# EAGLE design pb-switch-pcb (EAGLE 9.6.2)
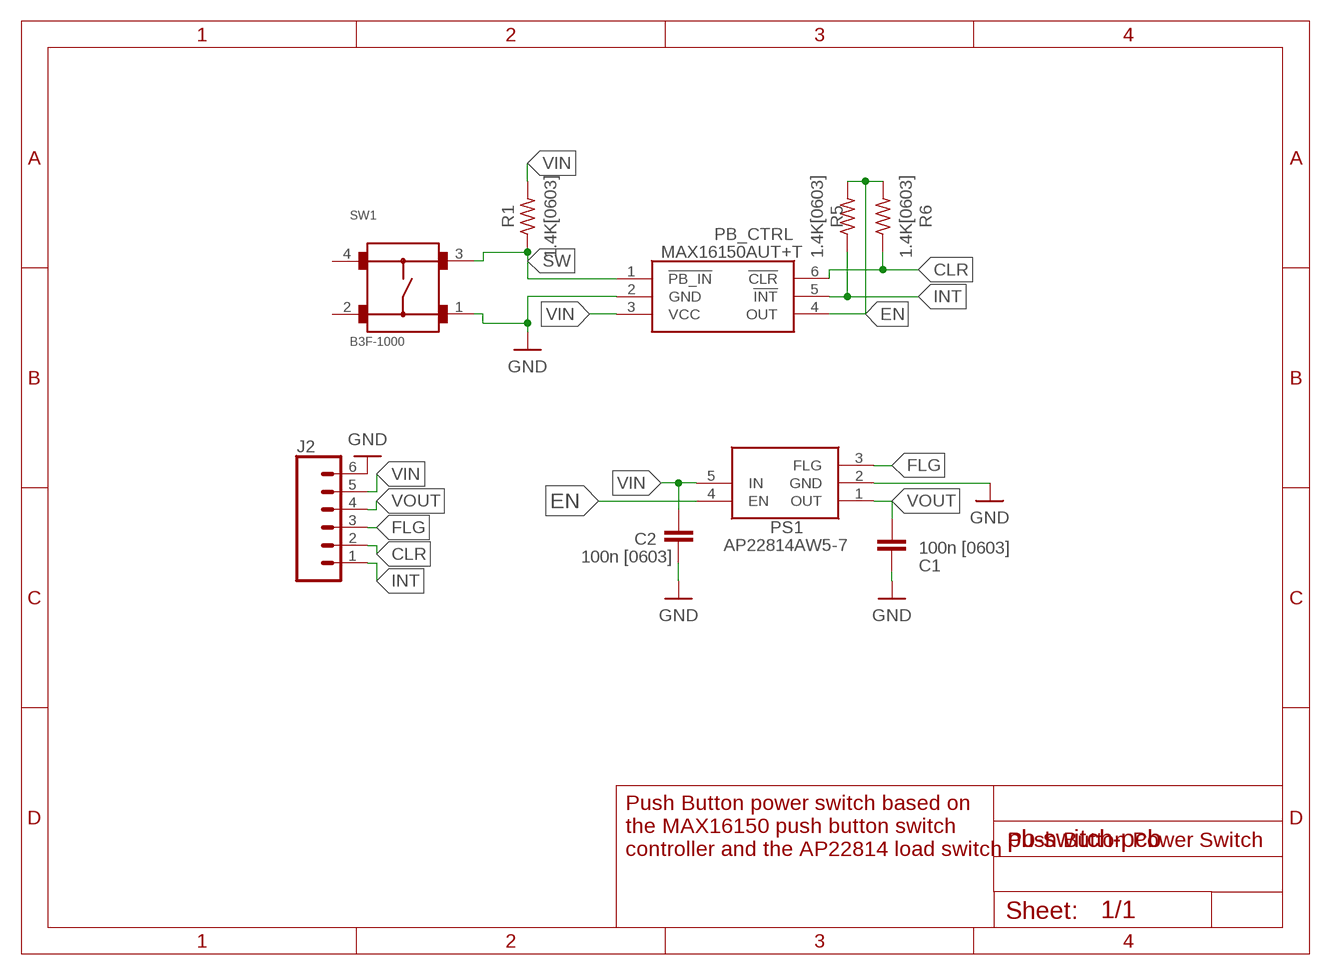
[diagram p0: schematic, sheet 1]

## Parts
C1  100n [0603]  C_CHIP-0603(1608-METRIC)  [CAPC1608X85]
C2  100n [0603]  C_CHIP-0603(1608-METRIC)  [CAPC1608X85]
J2  CONN_06SILK_FEMALE_PTH  [1X06]
PB_CTRL  MAX16150AUT+T  [SOT95P280X145-6N]
PS1  AP22814AW5-7  [SOT95P285X130-5N]
R1  1.4K[0603]  R-US_CHIP-0603(1608-METRIC)  [RESC1608X60]
R5  1.4K[0603]  R-US_CHIP-0603(1608-METRIC)  [RESC1608X60]
R6  1.4K[0603]  R-US_CHIP-0603(1608-METRIC)  [RESC1608X60]
SW1  B3F-1000  [B3F-1000]

## Nets
CLR: J2.2 PB_CTRL.6(!CLR) R6.1
EN: PB_CTRL.4(OUT) PS1.4(EN) R5.2 R6.2
FLG: J2.3 PS1.3(FLG)
GND: C1.2 C2.2 J2.6 PB_CTRL.2(GND) PS1.2(GND) SW1.1
INT: J2.1 PB_CTRL.5(!INT) R5.1
SW: PB_CTRL.1(!PB_IN) R1.1 SW1.3
VIN: C2.1 J2.5 PB_CTRL.3(VCC) PS1.5(IN) R1.2
VOUT: C1.1 J2.4 PS1.1(OUT)
Unconnected: SW1.2 SW1.4

## Notes on the sheet
- Push Button Power Switch
- Push Button power switch based on 
  the MAX16150 push button switch 
  controller and the AP22814 load switch

## Library data of the parts
C1 C2 = Capacitor:C: Capacitor - Generic; CATEGORY: Capacitor
J2 = SparkFun-Connectors:CONN_06: Multi connection point. Often used as Generic Header-pin footprint for 0.1 inch spaced/style header connections On any of the 0.1 inch spaced packages, you can populate with these: Break Away Headers - Straight <https://www.sparkfun.com/products/116> (PRT-00116) Break Away Male Headers - Right Angle <https://www.sparkfun.com/products/553> (PRT-00553) Female Headers <https://www.sparkfun.com/products/115> (PRT-00115) Break Away Headers - Machine Pin <https://www.sparkfun.com/products/117> (PRT-00117) Break Away Female Headers - Swiss Machine Pin <https://www.sparkfun.com/products/743> (PRT-00743) Arduino Stackable Header - 6 Pin <https://www.sparkfun.com/products/9280> (PRT-09280) For SCREWTERMINALS and SPRING TERMINALS visit here: Screw Terimnals on SparkFun.com <https://www.sparkfun.com/search/results?term=Screw+Terminals> (5mm/3.5mm/2.54mm spacing) This device is also useful as a general connection point to wire up your design to another part of your project. Our various solder wires solder well into these plated through hole pads. Hook-Up Wire - Assortment (Stranded, 22 AWG) <https://www.sparkfun.com/products/11375> (PRT-11375) Hook-Up Wire - Assortment (Solid Core, 22 AWG) <https://www.sparkfun.com/products/11367> (PRT-11367) View the entire wire category on our website here <https://www.sparkfun.com/categories/141>; PROD_ID: CONN-08437
PB_CTRL = MAX16150AUT+T:MAX16150AUT+T: Supervisory Circuits Nano-Power Pushbutton ON/OFF Controller with 15kV ESD Protection and Programmable Timer Source: Datasheet; DESCRIPTION: Supervisory Circuits Nano-Power Pushbutton ON/OFF Controller with 15kV ESD Protection and Programmable Timer; HEIGHT: 1.45mm; MANUFACTURER_NAME: Maxim Integrated; MANUFACTURER_PART_NUMBER: MAX16150AUT+T; MOUSER_PART_NUMBER: 700-MAX16150AUT+T; MOUSER_PRICE-STOCK: https://www.mouser.co.uk/ProductDetail/Maxim-Integrated/MAX16150AUT%2bT?qs=wnTfsH77Xs5xR8unQygqcw%3D%3D
PS1 = AP22814AW5-7:AP22814AW5-7: DiodesZetex AP22814AW5-7, USB Power Switch, High Side, 65m, 1.6 V min. 5-Pin, SOT25 Source: Datasheet <https://componentsearchengine.com/Datasheets/2/AP22814AW5-7.pdf>; DESCRIPTION: DiodesZetex AP22814AW5-7, USB Power Switch, High Side, 65m, 1.6 V min. 5-Pin, SOT25; HEIGHT: 1.3mm; MANUFACTURER_NAME: Diodes Inc.; MANUFACTURER_PART_NUMBER: AP22814AW5-7; MOUSER_PART_NUMBER: 621-AP22814AW5-7; MOUSER_PRICE-STOCK: https://www.mouser.co.uk/ProductDetail/Diodes-Incorporated/AP22814AW5-7?qs=lqAf%2FiVYw9i7Wkgkb62RxQ%3D%3D
R1 R5 R6 = Resistor:R-US: Resistor Fixed - ANSI; CATEGORY: Resistor; SUB-CATEGORY: Fixed
SW1 = Switch:B3F-1000: Tactile Switch SPST-NO Top Actuated Through Hole Manufacturer's datasheet <https://omronfs.omron.com/en_US/ecb/products/pdf/en-b3f.pdf>; CREATED_BY: PCBLayout.com; DIGI_KEY_PART_NUMBER: SW400-ND; MANUFACTURER: Omron Electronics Inc-EMC Div; MPN: B3F-1000; PACKAGE: SPST-NO

## Board
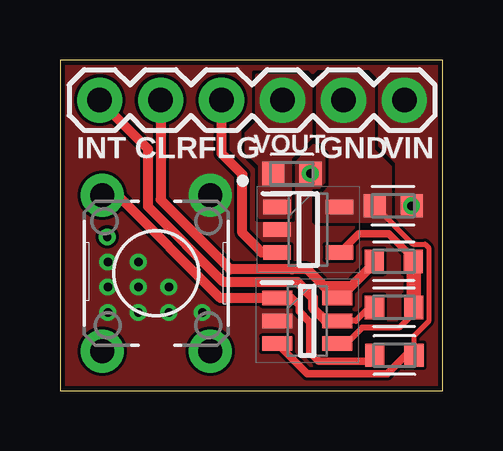
[diagram p1: board, top side]
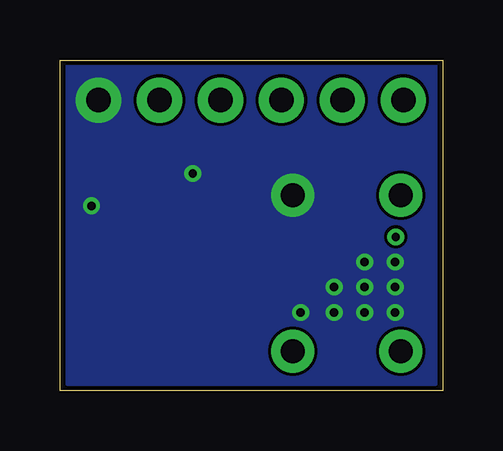
[diagram p2: board, bottom side, seen from below]

Size 15.96 x 13.77 mm. Coordinates in mm from the lower left corner, seen from the top.
Outline: 0.01,0 15.96,0 15.94,13.77 0,13.77 0.01,0
Copper layers (1*16): Top 0.035mm / dielectric 1.6mm / Bottom 0.035mm
Design rules "jlcpcb-2layer *": minimum track width 5mil, minimum drill 0.3mm, track to track 5mil, track to pad 5mil, pad to pad 5mil, via to via 5mil, smd to smd 5mil, copper to edge 0.2mm, drill to drill 6mil, minimum pad ring 10mil, minimum via ring 3mil, stop-mask expansion 4mil, vias tented up to drill 0mil, thermal gap 10mil

### Footprints (pad centres in the part's own frame; a part is rotated, then mirrored left to right if it is on the bottom)
CAPC1608X85 = smd 0.921 x 0.97: 1 -0.775,0; 2 0.775,0
1X06 = drill 1.016 pad 1.88: 1 0,0; 2 2.54,0; 3 5.08,0; 4 7.62,0; 5 10.16,0; 6 12.7,0
SOT95P280X145-6N = smd 1.25 x 0.6: 1 -1.25,0.95; 2 -1.25,0; 3 -1.25,-0.95; 4 1.25,-0.95; 5 1.25,0; 6 1.25,0.95
SOT95P285X130-5N = smd 1.15 x 0.6: 1 -1.3,0.95; 2 -1.3,0; 3 -1.3,-0.95; 4 1.3,-0.95; 5 1.3,0.95
RESC1608X60 = smd 0.799 x 0.974: 1 -0.815,0; 2 0.815,0
B3F-1000 = drill 1 pad 1.6: 1 -3.25,2.25; 2 3.25,2.25; 3 -3.25,-2.25; 4 3.25,-2.25

### Placement (x,y rotation side)
C1  9.66,9.04 0 top
C2  13.88,7.7 0 top
J2  1.65,12.1 0 top
PB_CTRL  10.3,2.9 0 top
PS1  10.34,6.71 0 top
R1  13.93,1.47 0 top
R5  13.92,3.47 0 top
R6  13.91,5.38 0 top
SW1  4.01,4.89 270 top

### Tracks (layer width: path | path; a pad name or v marks a point on that pad's centre or on a via)
CLR
  Top 0.406: J2.2 4.19,7.95 7.09,5.05 7.1,5.05 9.66,5.05 9.67,5.05 10.3,5.05 11,4.34 12.13,4.34 | R6.1 13.09,5.31 12.13,4.34 | 12.13,4.34 11.64,3.85 PB_CTRL.6
EN
  Top 0.254: R5.2 14.73,3.23 14.13,2.62 12.59,2.62 11.92,1.96 PB_CTRL.4
  Top 0.305: PS1.4 11.67,5.76 12.45,6.53 13.7,6.53 14.73,5.5 14.73,5.37
  Top 0.61: R6.2 14.73,5.37 R5.2
FLG
  Top 0.406: PS1.3 8.4,5.76 7.59,6.57 7.59,9 6.73,9.87 J2.3
GND  (via drill 0.35 pad 0.7)
  other vias: 1.99,5.36 3.26,5.36 1.99,4.32 3.26,4.32 4.53,4.32 1.99,3.25 3.26,3.25 4.53,3.25 5.93,3.25 14.64,7.7 10.43,9.04
  pour Top (rank 2, no thermals): 0.25,13.53 0.25,0.2 15.77,0.2 15.77,13.53
  pour Bottom (no thermals): 0.29,13.59 15.66,13.59 15.66,0.25 0.29,0.25
GND1  (via drill 0.35 pad 0.7)
  other vias: 1.97,6.4
INT
  Top 0.254: R5.1 13.08,3.45 12.87,3.45 12.33,2.9 PB_CTRL.5
  Top 0.406: J2.1 1.65,12.08 3.66,10.07 3.66,7.67 6.81,4.51 9.9,4.51 10.54,3.87 10.54,3.44 11.07,2.9 PB_CTRL.5
SW
  Top 0.305: PB_CTRL.1 9.07,3.88 9.63,3.88 9.96,3.55 9.96,3.3 10.41,2.84 10.41,1.59 10.78,1.22 13.12,1.22 R1.1 | 1.79,8.11 SW1.3
  Top 0.406: PB_CTRL.1 6.68,3.85 2.42,8.11 1.79,8.11
VIN
  Top 0.203: C2.1 14.7,6.1 15.22,6.1 15.36,5.95 15.36,2.88 14.75,2.27 R1.2
  Top 0.305: R1.2 14.4,1.47 13.63,0.71 10.3,0.71 PB_CTRL.3
  pour Top (no thermals): 13.55,7.06 10.81,7.06 10.71,7.16 10.71,8.2 10.96,8.2 11.26,8.51 11.26,9.96 10.73,10.49 10.73,13 10.88,13.16 12.71,13.16 13.04,12.83 13.04,10.03 13.75,9.32 13.75,7.26
VOUT
  pour Top (no thermals): 8.19,13.13 8.19,11.15 7.76,10.72 7.76,9.96 8.32,9.4 8.32,7.21 9.59,7.21 9.59,9.68 10.45,10.54 10.45,12.88 10.2,13.13

### Text on the board
tPlace: INT | CLR | FLG | VOUT | GND | VIN